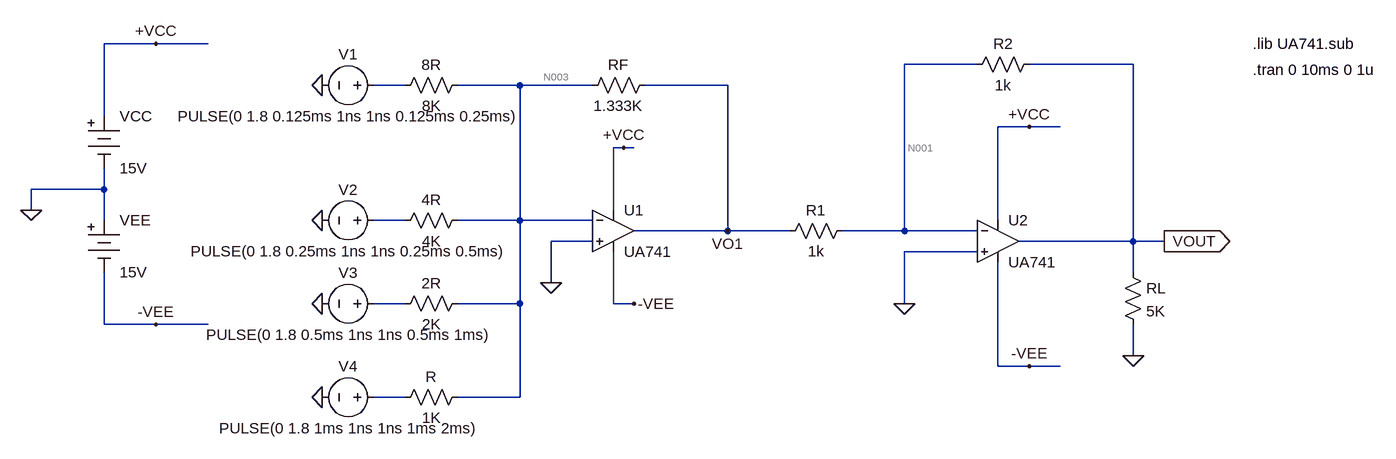
[diagram p0: schematic lab1-1.asc]
lab1-1.asc, the LTspice schematic file:
Version 4
SHEET 1 1628 724
WIRE -304 -96 -384 -96
WIRE -224 -96 -304 -96
WIRE 960 -64 848 -64
WIRE 1200 -64 1040 -64
WIRE 80 -32 32 -32
WIRE 256 -32 160 -32
WIRE 368 -32 256 -32
WIRE 576 -32 448 -32
WIRE -384 16 -384 -96
WIRE 1040 32 992 32
WIRE 1088 32 1040 32
WIRE 416 64 400 64
WIRE 432 64 416 64
WIRE -384 128 -384 96
WIRE -384 128 -496 128
WIRE -496 160 -496 128
WIRE 400 160 400 64
WIRE -384 176 -384 128
WIRE 80 176 32 176
WIRE 256 176 256 -32
WIRE 256 176 160 176
WIRE 368 176 256 176
WIRE 992 176 992 32
WIRE 576 192 576 -32
WIRE 576 192 432 192
WIRE 672 192 576 192
WIRE 848 192 848 -64
WIRE 848 192 752 192
WIRE 960 192 848 192
WIRE 368 208 304 208
WIRE 1200 208 1200 -64
WIRE 1200 208 1024 208
WIRE 1248 208 1200 208
WIRE 960 224 848 224
WIRE 1200 256 1200 208
WIRE 304 272 304 208
WIRE 80 304 32 304
WIRE 256 304 256 176
WIRE 256 304 160 304
WIRE 400 304 400 224
WIRE 432 304 400 304
WIRE 848 304 848 224
WIRE -384 336 -384 256
WIRE -304 336 -384 336
WIRE -224 336 -304 336
WIRE 1200 384 1200 336
WIRE 992 400 992 240
WIRE 1040 400 992 400
WIRE 1088 400 1040 400
WIRE 80 448 32 448
WIRE 256 448 256 304
WIRE 256 448 160 448
FLAG 1248 208 VOUT
IOPIN 1248 208 Out
FLAG -496 160 0
FLAG -304 -96 +VCC
FLAG 1040 32 +VCC
FLAG -304 336 -VEE
FLAG 1040 400 -VEE
FLAG 1200 384 0
FLAG 848 304 0
FLAG 416 64 +VCC
FLAG 432 304 -VEE
FLAG 576 192 VO1
FLAG 304 272 0
FLAG -48 -32 0
FLAG -48 176 0
FLAG -48 304 0
FLAG -48 448 0
SYMBOL Opamps\\opamp2 992 144 R0
SYMATTR InstName U2
SYMATTR Value UA741
SYMBOL res 1184 240 R0
SYMATTR InstName RL
SYMATTR Value 5K
SYMBOL Misc\\battery -384 0 R0
SYMATTR InstName VCC
SYMATTR Value 15V
SYMBOL Misc\\battery -384 160 R0
SYMATTR InstName VEE
SYMATTR Value 15V
SYMBOL res 768 176 R90
WINDOW 0 0 56 VBottom 2
WINDOW 3 32 56 VTop 2
SYMATTR InstName R1
SYMATTR Value 1k
SYMBOL res 1056 -80 R90
WINDOW 0 0 56 VBottom 2
WINDOW 3 32 56 VTop 2
SYMATTR InstName R2
SYMATTR Value 1k
SYMBOL Opamps\\opamp2 400 128 R0
SYMATTR InstName U1
SYMATTR Value UA741
SYMBOL res 464 -48 R90
WINDOW 0 0 56 VBottom 2
WINDOW 3 32 56 VTop 2
SYMATTR InstName RF
SYMATTR Value 1.333K
SYMBOL res 176 -48 R90
WINDOW 0 0 56 VBottom 2
WINDOW 3 32 56 VTop 2
SYMATTR InstName 8R
SYMATTR Value 8K
SYMBOL res 176 160 R90
WINDOW 0 0 56 VBottom 2
WINDOW 3 32 56 VTop 2
SYMATTR InstName 4R
SYMATTR Value 4K
SYMBOL res 176 288 R90
WINDOW 0 0 56 VBottom 2
WINDOW 3 32 56 VTop 2
SYMATTR InstName 2R
SYMATTR Value 2K
SYMBOL res 176 432 R90
WINDOW 0 0 56 VBottom 2
WINDOW 3 32 56 VTop 2
SYMATTR InstName R
SYMATTR Value 1K
SYMBOL voltage 48 -32 R90
WINDOW 0 -32 56 VBottom 2
WINDOW 3 32 56 VTop 2
WINDOW 123 0 0 Left 2
WINDOW 39 0 0 Left 2
SYMATTR InstName V1
SYMATTR Value PULSE(0 1.8 0.125ms 1ns 1ns 0.125ms 0.25ms)
SYMBOL voltage 48 176 R90
WINDOW 0 -32 56 VBottom 2
WINDOW 3 32 56 VTop 2
WINDOW 123 0 0 Left 2
WINDOW 39 0 0 Left 2
SYMATTR InstName V2
SYMATTR Value PULSE(0 1.8 0.25ms 1ns 1ns 0.25ms 0.5ms)
SYMBOL voltage 48 304 R90
WINDOW 0 -32 56 VBottom 2
WINDOW 3 32 56 VTop 2
WINDOW 123 0 0 Left 2
WINDOW 39 0 0 Left 2
SYMATTR InstName V3
SYMATTR Value PULSE(0 1.8 0.5ms 1ns 1ns 0.5ms 1ms)
SYMBOL voltage 48 448 R90
WINDOW 0 -32 56 VBottom 2
WINDOW 3 32 56 VTop 2
SYMATTR InstName V4
SYMATTR Value PULSE(0 1.8 1ms 1ns 1ns 1ms 2ms)
TEXT 1384 -96 Left 2 !.lib UA741.sub
TEXT 1384 -56 Left 2 !.tran 0 10ms 0 1u

The netlist it stands for:
* lab1-1.asc
XU2 0 N001 +VCC -VEE VOUT UA741  ; pins In+ In- V+ V- OUT
RL VOUT 0 5K
VCC +VCC 0 15V
VEE 0 -VEE 15V
R1 N001 VO1 1k
R2 VOUT N001 1k
XU1 0 N003 +VCC -VEE VO1 UA741  ; pins In+ In- V+ V- OUT
RF VO1 N003 1.333K
R§8R N003 N002 8K
R§4R N003 N004 4K
R§2R N003 N005 2K
R N003 N006 1K
V1 N002 0 PULSE(0 1.8 0.125ms 1ns 1ns 0.125ms 0.25ms)
V2 N004 0 PULSE(0 1.8 0.25ms 1ns 1ns 0.25ms 0.5ms)
V3 N005 0 PULSE(0 1.8 0.5ms 1ns 1ns 0.5ms 1ms)
V4 N006 0 PULSE(0 1.8 1ms 1ns 1ns 1ms 2ms)
.lib UA741.sub
.tran 0 10ms 0 1u
.backanno
.end

* Results of the author's LTspice run, read from the files saved beside the schematic
* Operating Point, zero values left out:
*   V(vout) = -43.33 µV
*   V(-vee) = -15 V
*   V(+vcc) = 15 V
*   V(n001) = 11.19 µV
*   V(vo1) = 145.5 µV
*   V(n003) = 11.18 µV
*   I(R) = 11.18 nA
*   I(2r) = 5.592 nA
*   I(4r) = 2.796 nA
*   I(8r) = 1.398 nA
*   I(Rf) = 100.7 nA
*   I(R2) = -54.51 nA
*   I(R1) = -134.3 nA
*   I(Rl) = -8.665 nA
*   I(V4) = 11.18 nA
*   I(V3) = 5.592 nA
*   I(V2) = 2.796 nA
*   I(V1) = 1.398 nA
*   I(Vee) = -3.333 mA
*   I(Vcc) = -3.333 mA
*   Ix(u2:1) = 79.74 nA
*   Ix(u2:2) = 79.76 nA
*   Ix(u2:3) = 1.667 mA
*   Ix(u2:4) = -1.667 mA
*   Ix(u2:5) = 63.18 nA
*   Ix(u1:1) = 79.74 nA
*   Ix(u1:2) = 79.76 nA
*   Ix(u1:3) = 1.667 mA
*   Ix(u1:4) = -1.667 mA
*   Ix(u1:5) = -235 nA
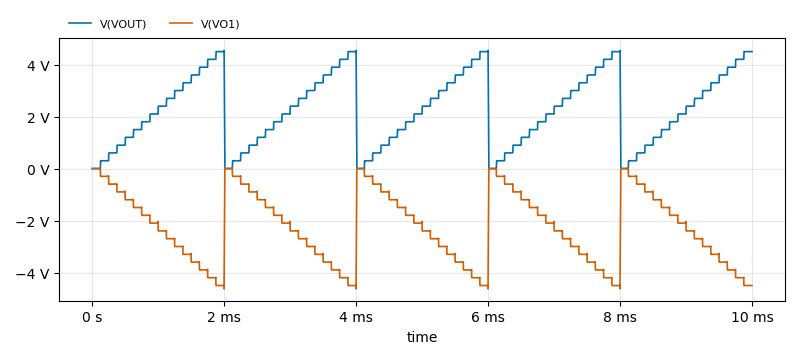
[diagram p1: Transient Analysis of lab1-1.asc, plotted from the saved traces]
* Transient Analysis, 1 run:
*   V(VOUT): min -1.608 mV, max 4.546 V, average 2.258 V, rms 2.645 V, last 4.499 V
*   V(VO1): min -4.624 V, max 8.527 mV, average -2.257 V, rms 2.644 V, last -4.499 V